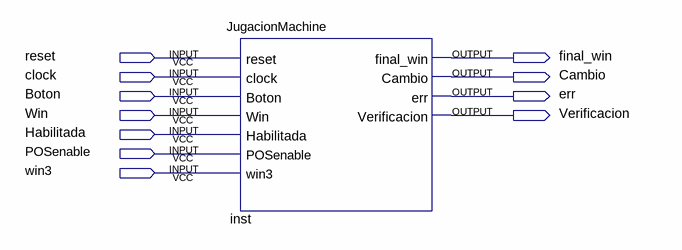
[diagram p0: schematic sheet]
// Quartus schematic Jugada1.bdf as structural Verilog: 1 symbols, 11 pins
module Jugada1 (
  input  reset,
  input  clock,
  input  Boton,
  input  Win,
  input  Habilitada,
  input  POSenable,
  input  win3,
  output final_win,
  output Cambio,
  output err,
  output Verificacion
);

  JugacionMachine inst (
    .reset(reset), .clock(clock), .Boton(Boton), .Win(Win), .Habilitada(Habilitada), .POSenable(POSenable),
    .win3(win3), .final_win(final_win), .Cambio(Cambio), .err(err), .Verificacion(Verificacion));
endmodule
